# EAGLE design GND_STN (EAGLE 9.6.2)
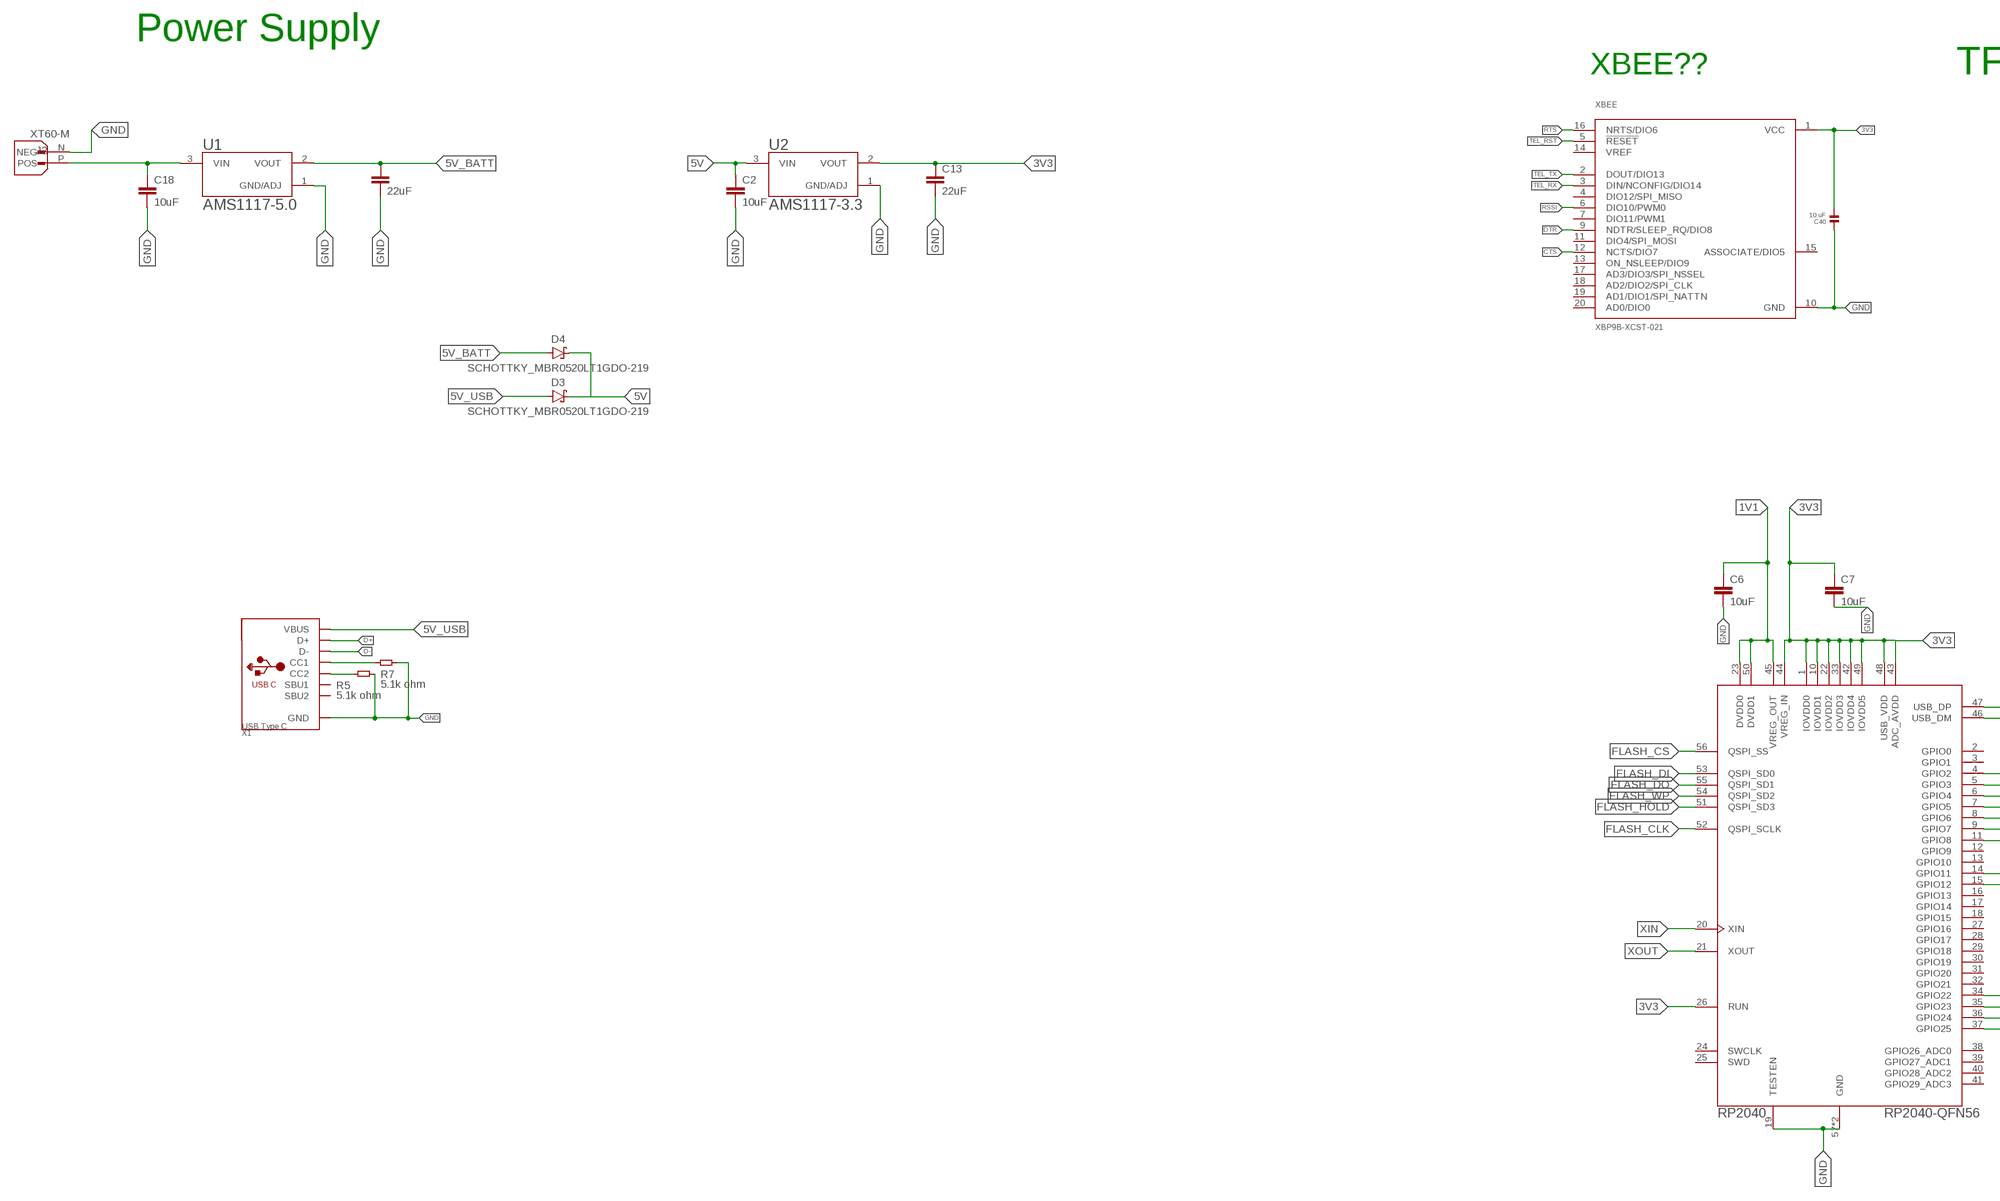
[diagram p0: schematic, sheet 1, part 1 of 2]
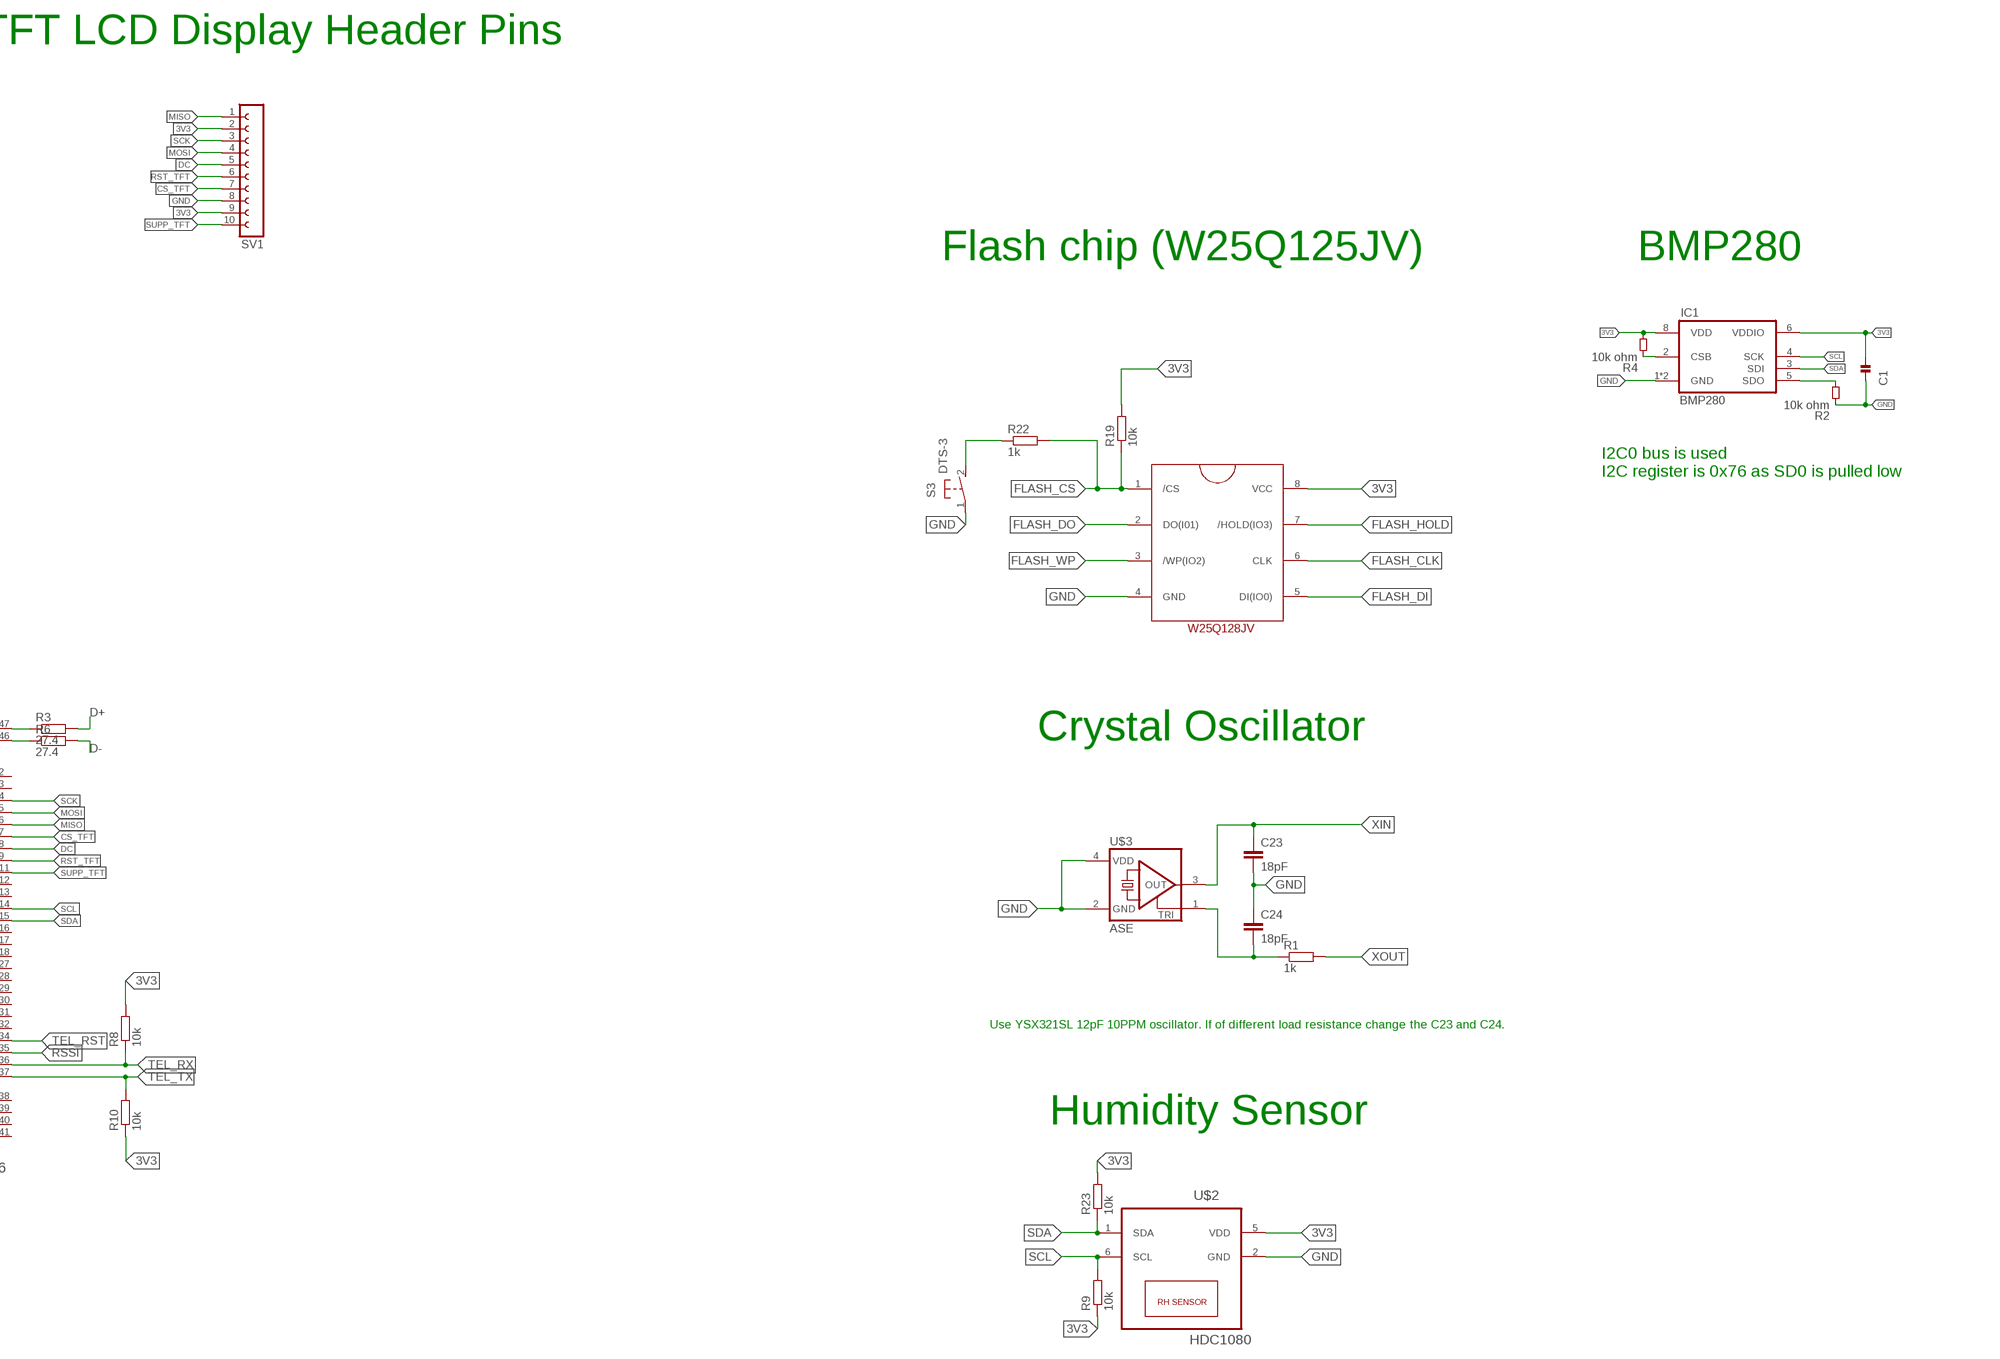
[diagram p1: schematic, sheet 1, part 2 of 2]

## Parts
C1  10 uF  CAPACITOR.0603  [0603]
C2  10uF  C-EUC0603  [C0603]
C3  22uF  C-EUC0603  [C0603]
C6  10uF  C-EUC0603  [C0603]
C7  10uF  C-EUC0603  [C0603]
C13  22uF  C-EUC0603  [C0603]
C18  10uF  C-EUC0603  [C0603]
C23  18pF  C-EUC0805  [C0805]
C24  18pF  C-EUC0805  [C0805]
C40  10 uF  CAPACITOR.0603  [0603]
D3  SCHOTTKY_MBR0520LT1GDO-219  [SODFL3718X115]
D4  SCHOTTKY_MBR0520LT1GDO-219  [SODFL3718X115]
IC1  BMP280  [BMP280]
J2  XT60-M  [AMASS_XT60-M]
R1  1k  R-EU_R0805  [R0805]
R2  10k ohm  RESISTOR.0603  [0603]
R3  27.4  R-EU_R0603  [R0603]
R4  10k ohm  RESISTOR.0603  [0603]
R5  5.1k ohm  RESISTOR.0603  [0603]
R6  27.4  R-EU_R0603  [R0603]
R7  5.1k ohm  RESISTOR.0603  [0603]
R8  10k  R-EU_R0603  [R0603]
R9  10k  R-EU_R0603  [R0603]
R10  10k  R-EU_R0603  [R0603]
R19  10k  R-EU_R0603  [R0603]
R22  1k  R-EU_R0603  [R0603]
R23  10k  R-EU_R0603  [R0603]
RP2040  RP2040-QFN56  [RP2040-QFN-56]
S3  DTS-3  [DTS-3]
SV1  FE10-1  [FE10]
U1  AMS1117-5.0  [SOT229P700X180-4N]
U2  AMS1117-3.3  [SOT229P700X180-4N]
U4  SOIC127P790X216-8NW25Q128JVJSQ  [SOIC127P790X216-8N]
U$2  HDC1080  [TI-S-PWSON-N6]
U$3  ASE  [ASE]
X1  USB Type C  USB_C  [USB_C_CUSB31-CFM2AX-01-X]
XBEE  XBP9B-XCST-021  [DIP2200W51P200L3294H279Q20P]

## Nets
1V1: C6.1 RP2040.23(DVDD0) RP2040.45(VREG_OUT) RP2040.50(DVDD1)
3V3: C1.2 C7.1 C13.1 C40.2 IC1.6(VDDIO) IC1.8(VDD) R4.2 R8.2 R9.1 R10.1 R19.2 R23.2 RP2040.1(IOVDD0) RP2040.10(IOVDD1) RP2040.22(IOVDD2) RP2040.26(RUN) RP2040.33(IOVDD3) RP2040.42(IOVDD4) RP2040.43(ADC_AVDD) RP2040.44(VREG_IN) RP2040.48(USB_VDD) RP2040.49(IOVDD5) SV1.2 SV1.9 U2.2(VOUT) U4.8(VCC) U$2.5(VDD) XBEE.1(VCC)
5V: C2.1 D3.1(C) D4.1(C) U2.3(VIN)
5V_BATT: C3.1 D4.2(A) U1.2(VOUT)
5V_USB: D3.2(A) X1.A4B9(VBUS) X1.B4A9(VBUS)
CC3: R5.1 X1.B5(CC2)
CC4: R7.1 X1.A5(CC1)
CS_TFT: RP2040.7(GPIO5) SV1.7
CSB: IC1.2(CSB) R4.1
CTS: XBEE.12(NCTS/DIO7)
D+: R3.2 X1.A6(D+) X1.B6(D+)
D-: R6.2 X1.A7(D-) X1.B7(D-)
DC: RP2040.8(GPIO6) SV1.5
DTR: XBEE.9(NDTR/SLEEP_RQ/DIO8)
FLASH_CLK: RP2040.52(QSPI_SCLK) U4.6(CLK)
FLASH_CS: R19.1 R22.2 RP2040.56(QSPI_SS) U4.1(/CS)
FLASH_DI: RP2040.53(QSPI_SD0) U4.5(DI(IO0))
FLASH_DO: RP2040.55(QSPI_SD1) U4.2(DO(I01))
FLASH_HOLD: RP2040.51(QSPI_SD3) U4.7(/HOLD(IO3))
FLASH_WP: RP2040.54(QSPI_SD2) U4.3(/WP(IO2))
GND: C1.1 C2.2 C3.2 C6.2 C7.2 C13.2 C18.2 C23.2 C24.1 C40.1 IC1.1(GND) IC1.7(GND) J2.N(NEG) R2.1 R5.2 R7.2 RP2040.19(TESTEN) RP2040.57(GND) RP2040.62(GND) S3.1 SV1.8 U1.1(GND/ADJ) U2.1(GND/ADJ) U4.4(GND) U$2.2(GND) U$3.2(GND) U$3.4(VDD) X1.A1B12(GND) X1.B1A12(GND) XBEE.10(GND)
MISO: RP2040.6(GPIO4) SV1.1
MOSI: RP2040.5(GPIO3) SV1.4
N$2: R22.1 S3.2
N$4: R3.1 RP2040.47(USB_DP)
N$5: R6.1 RP2040.46(USB_DM)
N$6: C24.2 R1.1 U$3.1(TRI)
N$16: C18.1 J2.P(POS) U1.3(VIN)
RSSI: RP2040.35(GPIO23) XBEE.6(DIO10/PWM0)
RST_TFT: RP2040.9(GPIO7) SV1.6
RTS: XBEE.16(NRTS/DIO6)
SCK: RP2040.4(GPIO2) SV1.3
SCL: IC1.4(SCK) R9.2 RP2040.14(GPIO11) U$2.6(SCL)
SDA: IC1.3(SDI) R23.1 RP2040.15(GPIO12) U$2.1(SDA)
SDO1: IC1.5(SDO) R2.2
SUPP_TFT: RP2040.11(GPIO8) SV1.10
TEL_RST: RP2040.34(GPIO22) XBEE.5(!RESET)
TEL_RX: R8.1 RP2040.36(GPIO24) XBEE.3(DIN/NCONFIG/DIO14)
TEL_TX: R10.2 RP2040.37(GPIO25) XBEE.2(DOUT/DIO13)
XIN: C23.1 RP2040.20(XIN) U$3.3(OUT)
XOUT: R1.2 RP2040.21(XOUT)
Unconnected: RP2040.2(GPIO0) RP2040.3(GPIO1) RP2040.12(GPIO9) RP2040.13(GPIO10) RP2040.16(GPIO13) RP2040.17(GPIO14) RP2040.18(GPIO15) RP2040.24(SWCLK) RP2040.25(SWD) RP2040.27(GPIO16) RP2040.28(GPIO17) RP2040.29(GPIO18) RP2040.30(GPIO19) RP2040.31(GPIO20) RP2040.32(GPIO21) RP2040.38(GPIO26_ADC0) RP2040.39(GPIO27_ADC1) RP2040.40(GPIO28_ADC2) RP2040.41(GPIO29_ADC3) X1.A8(SBU1) X1.B8(SBU2) XBEE.4(DIO12/SPI_MISO) XBEE.7(DIO11/PWM1) XBEE.11(DIO4/SPI_MOSI) XBEE.13(ON_NSLEEP/DIO9) XBEE.14(VREF) XBEE.15(ASSOCIATE/DIO5) XBEE.17(AD3/DIO3/SPI_NSSEL) XBEE.18(AD2/DIO2/SPI_CLK) XBEE.19(AD1/DIO1/SPI_NATTN) XBEE.20(AD0/DIO0)

## Notes on the sheet
- Power Supply
- XBEE?? | TFT LCD Display Header Pins
- Flash chip (W25Q125JV) | BMP280
- I2C0 bus is used
  I2C register is 0x76 as SD0 is pulled low
- Crystal Oscillator
- Use YSX321SL 12pF 10PPM oscillator. If of different load resistance change the C23 and C24.
- Humidity Sensor

## Library data of the parts
C1 C40 = standardparts:CAPACITOR
C2 C3 C6 C7 C13 C18 C23 C24 = rcl:C-EU: CAPACITOR, European symbol; SPICEPREFIX: C
D3 D4 = Diode:SCHOTTKY_: Schottky Diode - Popular parts; CATEGORY: Diode; DATASHEET: https://www.onsemi.com/download/data-sheet/pdf/mbr0520lt1-d.pdf; DESCRIPTION: Diode 20 V 500mA Surface Mount SOD-123; FORWARD_CURRENT: 500mA; FORWARD_VOLTAGE: 385mV; MANUFACTURER: onsemi; MPN: MBR0520LT1G; OPERATING_TEMPERATURE: -65°C ~ 125°C; PACKAGE_SIZE: SOD-123; PACKAGE_TYPE: SMD; PART_STATUS: ACTIVE; REVERSE_VOLTAGE: 20V; ROHS: COMPLIANT; SERIES: MBR0520; SUBCATEGORY: Schottky Diodes; TYPE: Schottky Power Rectifier; ZENER_VOLTAGE: NA
IC1 = BMP280-standalone:BMP280: The BMP280 is an absolute barometric pressure sensor especially designed for mobile applications. The sensor module is housed in an extremely compact 8-pin metal-lid LGA package with a footprint of only 2.0 × 2.5 mm2 and 0.95 mm package height. Its small dimensions and its low power consumption of 2.7 μA @1Hz allow the implementation in battery driven devices such as mobile phones, GPS modules or watches. The library has been designed by Richard Magdycz <https://www.facebook.com/groups/eaglecadsoftUK>
J2 = XT60-M:XT60-M: Check availability <https://pricing.snapeda.com/parts/XT60-M/AMASS/view-part?ref=eda>; AVAILABILITY: Not in stock; CHECK_PRICES: https://www.snapeda.com/parts/XT60-M/AMASS/view-part/?ref=eda; DESCRIPTION: Plug; DC supply; XT60; male; PIN: 2; for cable; soldered; 30A; 500V; MF: AMASS; MP: XT60-M; PACKAGE: Package; PRICE: None; SNAPEDA_LINK: https://www.snapeda.com/parts/XT60-M/AMASS/view-part/?ref=snap
R1 R3 R6 R8-R10 R19 R22 R23 = rcl:R-EU_: RESISTOR, European symbol; SPICEPREFIX: R
R2 R4 R5 R7 = standardparts:RESISTOR
RP2040 = RpiPico:RP2040-QFN56
S3 = DTS-3:DTS-3: Check availability <https://pricing.snapeda.com/parts/DTS-3/APEM%20Inc./view-part?ref=eda>; AVAILABILITY: Not in stock; CHECK_PRICES: https://www.snapeda.com/parts/DTS-3/APEM/view-part/?ref=eda; DESCRIPTION: Tactile Switch SPST-NO Top Actuated Through Hole; MF: APEM Inc.; MP: DTS-3; PACKAGE: DIP-10 APEM Inc.; PRICE: None; SNAPEDA_LINK: https://www.snapeda.com/parts/DTS-3/APEM/view-part/?ref=snap
SV1 = con-lsta:FE10-1: FEMALE HEADER; OC_FARNELL: unknown; OC_NEWARK: unknown
U1 = AMS1117-5.0:AMS1117-5.0: Check availability <https://pricing.snapeda.com/parts/AMS1117-5.0/Advanced%20Monolithic%20Systems/view-part?ref=eda>; AVAILABILITY: Not in stock; CHECK_PRICES: https://www.snapeda.com/parts/AMS1117-5.0/Advanced+Monolithic+Systems/view-part/?ref=eda; DESCRIPTION: Sot223/Pkg 1-Amp 5-Volt Low Drop Out Voltage Regulatator; MF: Advanced Monolithic Systems; MP: AMS1117-5.0; PACKAGE: SOT-223 Seeed Technology; PRICE: None; SNAPEDA_LINK: https://www.snapeda.com/parts/AMS1117-5.0/Advanced+Monolithic+Systems/view-part/?ref=snap
U2 = AMS1117-3.3:AMS1117-3.3: Check availability <https://pricing.snapeda.com/parts/AMS1117-3.3/Advanced%20Monolithic%20Systems/view-part?ref=eda>; AVAILABILITY: Not in stock; CHECK_PRICES: https://www.snapeda.com/parts/AMS1117-3.3/Advanced+Monolithic+Systems/view-part/?ref=eda; DESCRIPTION: Sot223/Pkg 1-Amp 3.3-Volt Low Drop Out Voltage Regulatator; MF: Advanced Monolithic Systems; MP: AMS1117-3.3; PACKAGE: SOT-223 Seeed Technology; PRICE: None; SNAPEDA_LINK: https://www.snapeda.com/parts/AMS1117-3.3/Advanced+Monolithic+Systems/view-part/?ref=snap
U4 = SOIC127P790X216-8N:SOIC127P790X216-8N
U$2 = Texas-HDC1080:HDC1080
U$3 = crystal:ASE: 3.3Vdc CMOS SMD CRYSTAL CLOCK OSCILLATOR SOurce: www.abracon.com; OC_FARNELL: unknown; OC_NEWARK: unknown
X1 = microbuilder:USB_C: USB Type-C USB 2.0 Connector
XBEE = XBP9B-XCST-021:XBP9B-XCST-021: XBee-PRO 900HP DigiMesh 900 MHz 200 Kbps RF Module with U.FL Connector Check availability <https://pricing.snapeda.com/parts/XBP9B-XCST-021/Digi%20International/view-part?ref=eda>; AVAILABILITY: In Stock; CHECK_PRICES: https://www.snapeda.com/parts/XBP9B-XCST-021/Digi+International/view-part/?ref=eda; DESCRIPTION: General ISM < 1GHz - Transceiver Module 920MHz Antenna Not Included, RP-SMA Through Hole; MF: Digi International; MP: XBP9B-XCST-021; PACKAGE: Module Digi International; PRICE: None; PURCHASE-URL: https://www.snapeda.com/api/url_track_click_mouser/?unipart_id=521579&manufacturer=Digi International&part_name=XBP9B-XCST-021&search_term=None; SNAPEDA_LINK: https://www.snapeda.com/parts/XBP9B-XCST-021/Digi+International/view-part/?ref=snap

## Board
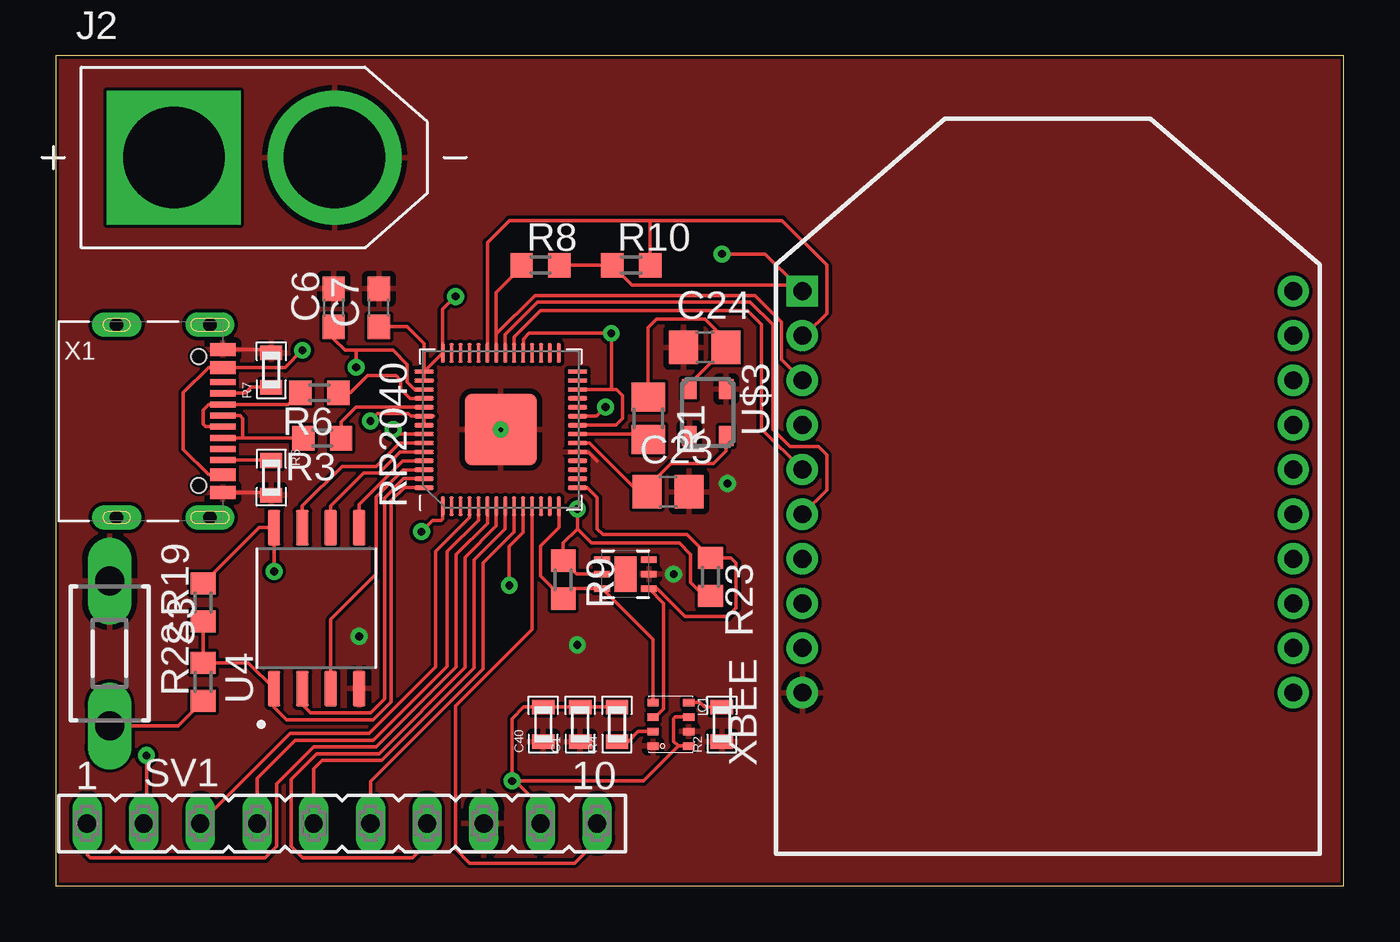
[diagram p2: board, top side]
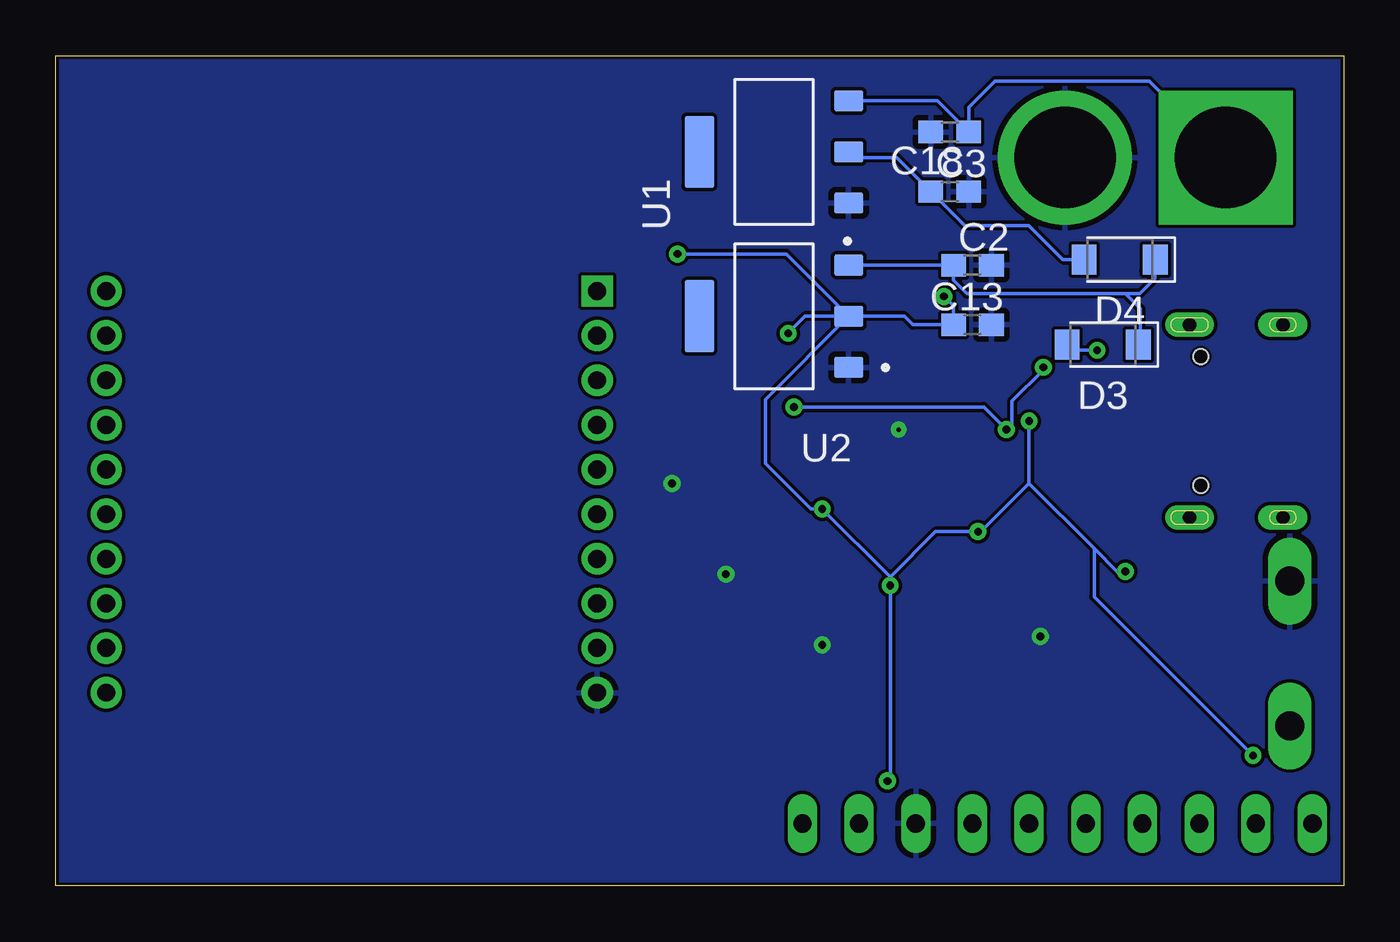
[diagram p3: board, bottom side, seen from below]

Size 57.71 x 37.2 mm. Coordinates in mm from the lower left corner, seen from the top.
Outline: 0,0 57.71,0 57.71,37.2 0,37.2 0,0
Copper layers (1*16): Top 0.035mm / dielectric 1.5mm / Bottom 0.035mm
Design rules "default *": minimum track width 0.15mm, minimum drill 0.2mm, track to track 0.15mm, track to pad 0.15mm, pad to pad 0.15mm, via to via 0.15mm, smd to smd 0.15mm, copper to edge 0.15mm, drill to drill 6mil, minimum pad ring 10mil, minimum via ring 8mil, stop-mask expansion 4mil, vias tented up to drill 0mil, thermal gap 10mil

### Footprints (pad centres in the part's own frame; a part is rotated, then mirrored left to right if it is on the bottom)
0603 = smd 0.65 x 1: 1 -0.775,0; 2 0.775,0
C0603 = smd 1.1 x 1: 1 -0.85,0; 2 0.85,0
C0805 = smd 1.3 x 1.5: 1 -0.95,0; 2 0.95,0
SODFL3718X115 = smd 1.115 x 1.361: 1 -1.6,0; 2 1.6,0
BMP280 = smd 0.35 x 0.5: 1 0.975,-0.8; 2 0.325,-0.8; 3 -0.325,-0.8; 4 -0.975,-0.8; 5 -0.975,0.8; 6 -0.325,0.8; 7 0.325,0.8; 8 0.975,0.8
AMASS_XT60-M = drill 4.55 pad 6: N 3.6,0 | drill 4.55 pad 6 square: P -3.6,0
R0805 = smd 1.3 x 1.5: 1 -0.95,0; 2 0.95,0
R0603 = smd 1 x 1.1: 1 -0.85,0; 2 0.85,0
RP2040-QFN-56 = smd 0.875 x 0.2: 1 -3.438,2.6; 2 -3.438,2.2; 3 -3.438,1.8; 4 -3.438,1.4; 5 -3.438,1; 6 -3.438,0.6; 7 -3.438,0.2; 8 -3.438,-0.2; 9 -3.438,-0.6; 10 -3.438,-1; 11 -3.438,-1.4; 12 -3.438,-1.8; 13 -3.438,-2.2; 14 -3.438,-2.6; 29 3.438,-2.6; 30 3.438,-2.2; 31 3.438,-1.8; 32 3.438,-1.4; 33 3.438,-1; 34 3.438,-0.6; 35 3.438,-0.2; 36 3.438,0.2; 37 3.438,0.6; 38 3.438,1; 39 3.438,1.4; 40 3.438,1.8; 41 3.438,2.2; 42 3.438,2.6 | smd 0.2 x 0.875: 15 -2.6,-3.438; 16 -2.2,-3.438; 17 -1.8,-3.438; 18 -1.4,-3.438; 19 -1,-3.438; 20 -0.6,-3.438; 21 -0.2,-3.438; 22 0.2,-3.438; 23 0.6,-3.438; 24 1,-3.438; 25 1.4,-3.438; 26 1.8,-3.438; 27 2.2,-3.438; 28 2.6,-3.438; 43 2.6,3.438; 44 2.2,3.438; 45 1.8,3.438; 46 1.4,3.438; 47 1,3.438; 48 0.6,3.438; 49 0.2,3.438; 50 -0.2,3.438; 51 -0.6,3.438; 52 -1,3.438; 53 -1.4,3.438; 54 -1.8,3.438; 55 -2.2,3.438; 56 -2.6,3.438 | smd 3.2 x 3.2: 57 0,0 | drill 0.2 pad 0.6: 62 0,0
DTS-3 = drill 1.3 long: 1 -3.25,0; 2 3.25,0
FE10 = drill 0.813 long: 1 -11.43,0; 2 -8.89,0; 3 -6.35,0; 4 -3.81,0; 5 -1.27,0; 6 1.27,0; 7 3.81,0; 8 6.35,0; 9 8.89,0; 10 11.43,0
SOT229P700X180-4N = smd 0.93 x 1.31: 1 -2.29,-3.345; 2 0,-3.345; 3 2.29,-3.345 | smd 3.24 x 1.31: 4 0,3.345
SOT229P700X180-4N' = smd 1.31 x 0.93: 1 -3.345,2.29; 2 -3.345,0; 3 -3.345,-2.29 | smd 1.31 x 3.24: 4 3.345,0
SOIC127P790X216-8N = smd 1.61 x 0.58: 1 -3.605,1.905; 2 -3.605,0.635; 3 -3.605,-0.635; 4 -3.605,-1.905; 5 3.605,-1.905; 6 3.605,-0.635; 7 3.605,0.635; 8 3.605,1.905
TI-S-PWSON-N6 = smd 0.3 x 0.7: 1 -0.65,-1.05; 2 0,-1.05; 3 0.65,-1.05; 4 0.65,1.05; 5 0,1.05; 6 -0.65,1.05 | smd 1.6 x 1: 7 0,0
ASE = smd 0.9 x 0.65: 1 -1.05,-0.825; 2 1.05,-0.825; 3 1.05,0.825; 4 -1.05,0.825
USB_C_CUSB31-CFM2AX-01-X = smd 0.575 x 1.15: A1B12 -3.2,3.545; A4B9 -2.4,3.545; B1A12 3.2,3.545; B4A9 2.4,3.545 | smd 0.275 x 1.15: A5 -1.25,3.545; A6 -0.25,3.545; A7 0.25,3.545; A8 1.25,3.545; B5 1.75,3.545; B6 0.75,3.545; B7 -0.75,3.545; B8 -1.75,3.545 | drill 0.6 pad 1 long: M1 -4.32,2.97; M2 4.32,2.97; M3 -4.32,-1.21; M4 4.32,-1.21 | hole 0.65: 2.89,2.47; -2.89,2.47
DIP2200W51P200L3294H279Q20P = drill 0.8 pad 1.4 square: 1 -11,8.75 | drill 0.8 pad 1.4: 2 -11,6.75; 3 -11,4.75; 4 -11,2.75; 5 -11,0.75; 6 -11,-1.25; 7 -11,-3.25; 8 -11,-5.25; 9 -11,-7.25; 10 -11,-9.25; 11 11,-9.25; 12 11,-7.25; 13 11,-5.25; 14 11,-3.25; 15 11,-1.25; 16 11,0.75; 17 11,2.75; 18 11,4.75; 19 11,6.75; 20 11,8.75

### Placement (x,y rotation side)
C1  23.5,7.24 90 top
C2  16.64,27.81 0 bottom
C3  17.65,31.11 0 bottom
C6  12.45,25.91 90 top
C7  14.48,25.91 90 top
C13  16.64,25.15 0 bottom
C18  17.65,33.78 180 bottom
C23  27.43,17.65 0 top
C24  29.08,24.13 0 top
C40  21.84,7.24 90 top
D3  10.79,24.26 180 bottom
D4  10.03,28.07 180 bottom
IC1  27.56,7.24 270 top
J2  8.89,32.64 0 top
R1  26.54,20.96 270 top
R2  29.84,7.24 90 top
R3  11.94,20.07 180 top
R4  25.15,7.24 90 top
R5  9.65,18.29 270 top
R6  11.81,22.1 180 top
R7  9.65,23.11 90 top
R8  21.72,27.81 0 top
R9  22.73,13.72 270 top
R10  25.78,27.81 0 top
R19  6.6,12.7 90 top
R22  6.6,9.14 90 top
R23  29.34,13.84 270 top
RP2040  19.94,20.45 90 top
S3  2.41,10.41 270 top
SV1  12.83,2.79 0 top
U1  25.53,32.89 90 bottom
U2  AMS1117-3.3  [SOT229P700X180-4N']  25.53,25.53 180 bottom
U4  11.68,12.45 90 top
U$2  25.53,13.97 90 top
U$3  29.21,21.21 270 top
X1  3.94,20.83 270 top
XBEE  44.45,17.91 0 top

### Tracks (layer width: path | path; a pad name or v marks a point on that pad's centre or on a via)
1V1  (via drill 0.35)
  Top 0.152: C6.1 12.45,24.51 12.95,24 13.46,24 | RP2040.45 16.48,22.22 16.09,22.22 15.75,22.57 15.75,23.37 15.11,24 13.46,24 | 13.46,24 v13.46,23.24 | RP2040.50 15.31,20.25 v15.11,20.45 | RP2040.23 24.22,21.05 v24.64,21.46
  Bottom 0.152: v13.46,23.24 13.46,23.11 14.86,21.72 14.86,20.7 v15.11,20.45 16.13,21.46 v24.64,21.46
3V3  (via drill 0.35)
  Top 0.152: v17.91,26.42 17.34,25.85 RP2040.42 RP2040.43 | C7.1 15.75,25.06 16.5,24.31 RP2040.43 | RP2040.43 RP2040.44 16.89,22.65 | 16.93,21.05 RP2040.48 | RP2040.48 RP2040.49 | R19.2 9.11,16.05 U4.8 v9.78,14.1 | v4.06,5.84 4.06,2.92 SV1.2 | R8.2 R10.1 25.82,26.92 33.18,26.92 | 33.18,26.92 XBEE.1 | v29.84,28.32 31.79,28.32 33.18,26.92 | 20.57,4.7 v20.45,4.7 20.45,7.49 20.97,8.01 C40.2 C1.2 R4.2 | 20.57,4.7 21.72,3.56 SV1.9 | R23.2 29.04,12.99 28.45,13.59 28.45,14.86 27.94,15.37 24,15.37 23.37,16 | IC1.6 27.76,7.56 27.69,7.49 27.69,6.48 27.9,6.26 | 27.9,6.26 IC1.8 | 27.9,6.26 26.33,4.7 20.57,4.7 | 20.94,23.75 RP2040.33 20.95,23.9 20.95,24.51 21.21,24.77 v24.89,24.77 24.89,22.25 | RP2040.26 24.89,22.25 | RP2040.22 25.09,20.65 25.4,20.96 25.4,21.97 25.12,22.25 24.89,22.25 | U$2.5 23.33,13.97 R9.1 22.73,15.37 23.37,16 | 23.37,16 v23.37,16.89 | RP2040.10 20.94,15.84 20.32,15.22 v20.32,13.46 | v16.38,15.88 16.89,16.38 17.27,16.38 17.34,16.45 RP2040.1 | RP2040.48 15.91,21.05 15.8,21.16 14.43,21.16 v14.1,20.83
  Bottom 0.152: U2.2 19.68,25.53 19.3,25.15 C13.1 17.49,26 v17.91,26.42 | U2.2 24.98,28.32 v29.84,28.32 | U2.2 25.91,21.8 25.91,18.92 23.88,16.89 v23.37,16.89 20.32,13.84 | 20.32,13.84 v20.32,13.46 20.32,4.83 v20.45,4.7 | 20.32,13.84 18.29,15.88 v16.38,15.88 16.26,15.88 14.1,18.03 | v14.1,20.83 14.1,18.03 | U2.2 24.13,25.53 v24.89,24.77 | 14.1,18.03 11.18,15.11 | 11.18,15.11 10.16,14.1 v9.78,14.1 | 11.18,15.11 11.18,12.95 v4.06,5.84
5V
  Bottom 0.152: C2.1 | C2.1 U2.3 | D3.1 9.2,24.51 9.11,24.6 | 9.11,24.6 8.94,24.77 | 9.78,26.54 16.89,26.54 17.49,27.14 C2.1 | D4.1 8.47,28.03 | 8.47,28.03 8.94,27.56 | 9.78,26.54 9.14,26.54 8.47,27.22 8.47,28.03 | 9.11,24.6 9.11,25.87 9.78,26.54
5V_BATT
  Bottom 0.152: U1.2 21.93,32.64 20.03,32.64 C3.1 16.98,29.59 14.1,29.59 12.57,28.07 D4.2
5V_USB  (via drill 0.35)
  Top 0.152: v11.05,24 10.27,23.23 X1.A4B9 6.84,23.23 5.71,22.1 5.71,19.56 6.84,18.43 X1.B4A9
  Bottom 0.152: D3.2 12.39,24 v11.05,24
CC3
  Top 0.152: X1.B5 9.64,19.08 R5.1
CC4
  Top 0.152: X1.A5 8.49,22.08 8.76,22.35 9.64,22.35 R7.1
CS_TFT
  Top 0.152: SV1.7 16.64,1.91 15.98,1.25 11.07,1.25 10.54,1.78 10.54,4.78 11.68,5.92 14.48,5.92 18.34,9.79 18.34,14.72 19.74,16.12 RP2040.7
CSB
  Top 0.152: R4.1 25.64,6.46 26.09,6.91 IC1.2
D+
  Top 0.152: X1.B6 8.38,20.08 | 8.38,20.08 10.78,20.08 10.79,20.07 R3.2 | X1.A6 8.26,21.08 8.38,20.96 8.38,20.08
D-
  Top 0.152: R6.2 10.92,22.1 10.4,21.58 X1.B7 6.85,21.58 6.6,21.34 6.6,20.7 6.73,20.58 X1.A7
DC
  Top 0.152: SV1.5 11.56,5.24 11.94,5.62 14.6,5.62 18.74,9.76 18.74,14.6 20.14,15.99 RP2040.8
FLASH_CLK
  Top 0.152: RP2040.52 15.43,19.45 14.48,18.49 13.79,18.49 12.32,17.02 U4.6
FLASH_CS
  Top 0.152: RP2040.56 15.62,17.85 15.03,17.26 15.03,8.26 14.22,7.45 10.34,7.45 9.78,8 U4.1 8.63,9.99 R22.2 R19.1
FLASH_DI
  Top 0.152: U4.5 13.59,17.1 15.54,19.05 RP2040.53
FLASH_DO
  Top 0.152: RP2040.55 15.59,18.25 14.73,17.39 14.73,8.38 14.1,7.75 11.43,7.75 11.05,8.13 U4.2
FLASH_HOLD
  Top 0.152: U4.7 11.05,17.02 12.83,18.8 14.35,18.8 15.4,19.85 RP2040.51
FLASH_WP
  Top 0.152: U4.3 12.32,11.94 14.35,13.97 14.35,17.43 15.56,18.65 RP2040.54
GND  (via drill 0.35)
  Top 0.152: X1.A1B12 9.51,24.03 R7.2 | X1.B1A12 9.54,17.63 R5.2 | RP2040.19 23.39,19.43 23.88,19.43 24.26,19.05
  Bottom 0.152: C3.2 16.8,31.41
  other vias: 30.1,18.03 27.69,13.97 23.37,10.79 13.59,11.18
  pour Top: -2.54,36.45 -2.54,0 -0.13,-2.41 57.4,-2.41 59.94,0.13 59.94,37.21 57.91,39.24 -0.13,39.24 -2.79,36.58 -2.67,36.45
  pour Bottom: -5.08,36.45 -5.08,-0.38 0.38,-5.84 57.91,-5.84 62.48,-1.27 62.48,37.21 62.23,37.47 58.17,41.53 1.27,41.53 0,41.53
MISO
  Top 0.152: SV1.1 1.4,1.4 1.55,1.25 9.38,1.25 9.91,1.77 9.91,4.58 11.55,6.22 14.35,6.22 17.94,9.81 17.94,14.85 19.34,16.25 RP2040.6
MOSI
  Top 0.152: SV1.4 9.02,4.83 10.72,6.53 14.23,6.53 17.54,9.84 17.54,14.98 18.94,16.38 RP2040.5
N$2
  Top 0.152: S3.2 5.47,7.16 R22.1
N$4
  Top 0.152: RP2040.47 16.48,21.46 13.46,21.46 12.79,20.79 R3.1
N$5
  Top 0.152: 12.91,21.84 R6.1 13.21,22.1 13.78,22.67 13.97,22.86 15.24,22.86 15.45,22.65 15.45,22.27 15.88,21.84 RP2040.46
N$6
  Top 0.152: U$3.1 28.39,22.48 C24.2 30.03,24.45 29.08,25.4 26.92,25.4 26.54,25.02 R1.1
N$16
  Bottom 0.152: J2.P 8.72,36.07 15.62,36.07 16.8,34.89 C18.1 18.2,35.18 U1.3
RSSI
  Top 0.152: XBEE.6 34.54,17.75 34.54,19.3 34.16,19.68 32.89,19.68 32.13,20.45 32.13,25.15 31.11,26.16 21.59,26.16 20.14,24.71 RP2040.35
RST_TFT
  Top 0.152: SV1.6 14.1,4.69 19.14,9.73 19.14,14.47 20.54,15.87 RP2040.9
SCK
  Top 0.152: SV1.3 10.51,6.83 14.03,6.83 17.02,9.81 17.02,14.98 18.54,16.5 RP2040.4
SCL
  Top 0.152: RP2040.14 22.54,16.06 21.72,15.24 21.72,13.88 R9.2 23.19,13.32 U$2.6 26.76,11.04 IC1.4
SDA
  Top 0.152: RP2040.15 23.81,17.85 24.26,17.4 24.26,16 24.51,15.75 28.28,15.75 R23.1 30.27,14.69 30.48,14.48 30.48,12.45 30.1,12.07 28.19,12.07 26.94,13.32 U$2.1 27.23,12.66 27.23,7.93 26.87,7.56 IC1.3
SDO1
  Top 0.152: IC1.5 28.87,8.21 29.07,8.01 R2.2
SUPP_TFT
  Top 0.152: RP2040.11 21.34,11.5 17.91,8.07 17.91,1.65 18.54,1.02 23.24,1.02 24.26,2.03 SV1.10
TEL_RST
  Top 0.152: XBEE.5 31.62,20.48 31.62,25.15 30.99,25.78 21.72,25.78 20.54,24.6 RP2040.34
TEL_RX
  Top 0.152: XBEE.3 32.51,23.6 32.51,25.27 31.32,26.46 21.46,26.46 19.74,24.74 | 19.74,24.74 RP2040.36 | R8.1 20.87,27.72 19.74,26.6 19.74,24.74
TEL_TX
  Top 0.152: 26.67,29.82 32.54,29.82 34.54,27.81 34.54,25.65 33.66,24.77 33.56,24.77 XBEE.2 | 26.67,29.82 20.32,29.82 19.34,28.83 RP2040.37 | R10.2 26.63,29.78 26.67,29.82
XIN
  Top 0.152: RP2040.20 23.91,19.85 26.1,17.65 C23.1 26.51,17.65 26.51,17.88 27.56,18.92 29.46,18.92 30.04,19.49 U$3.3
XOUT
  Top 0.152: R1.2 26.3,20.25 RP2040.21